# EAGLE design v1 (EAGLE 7.6.0)
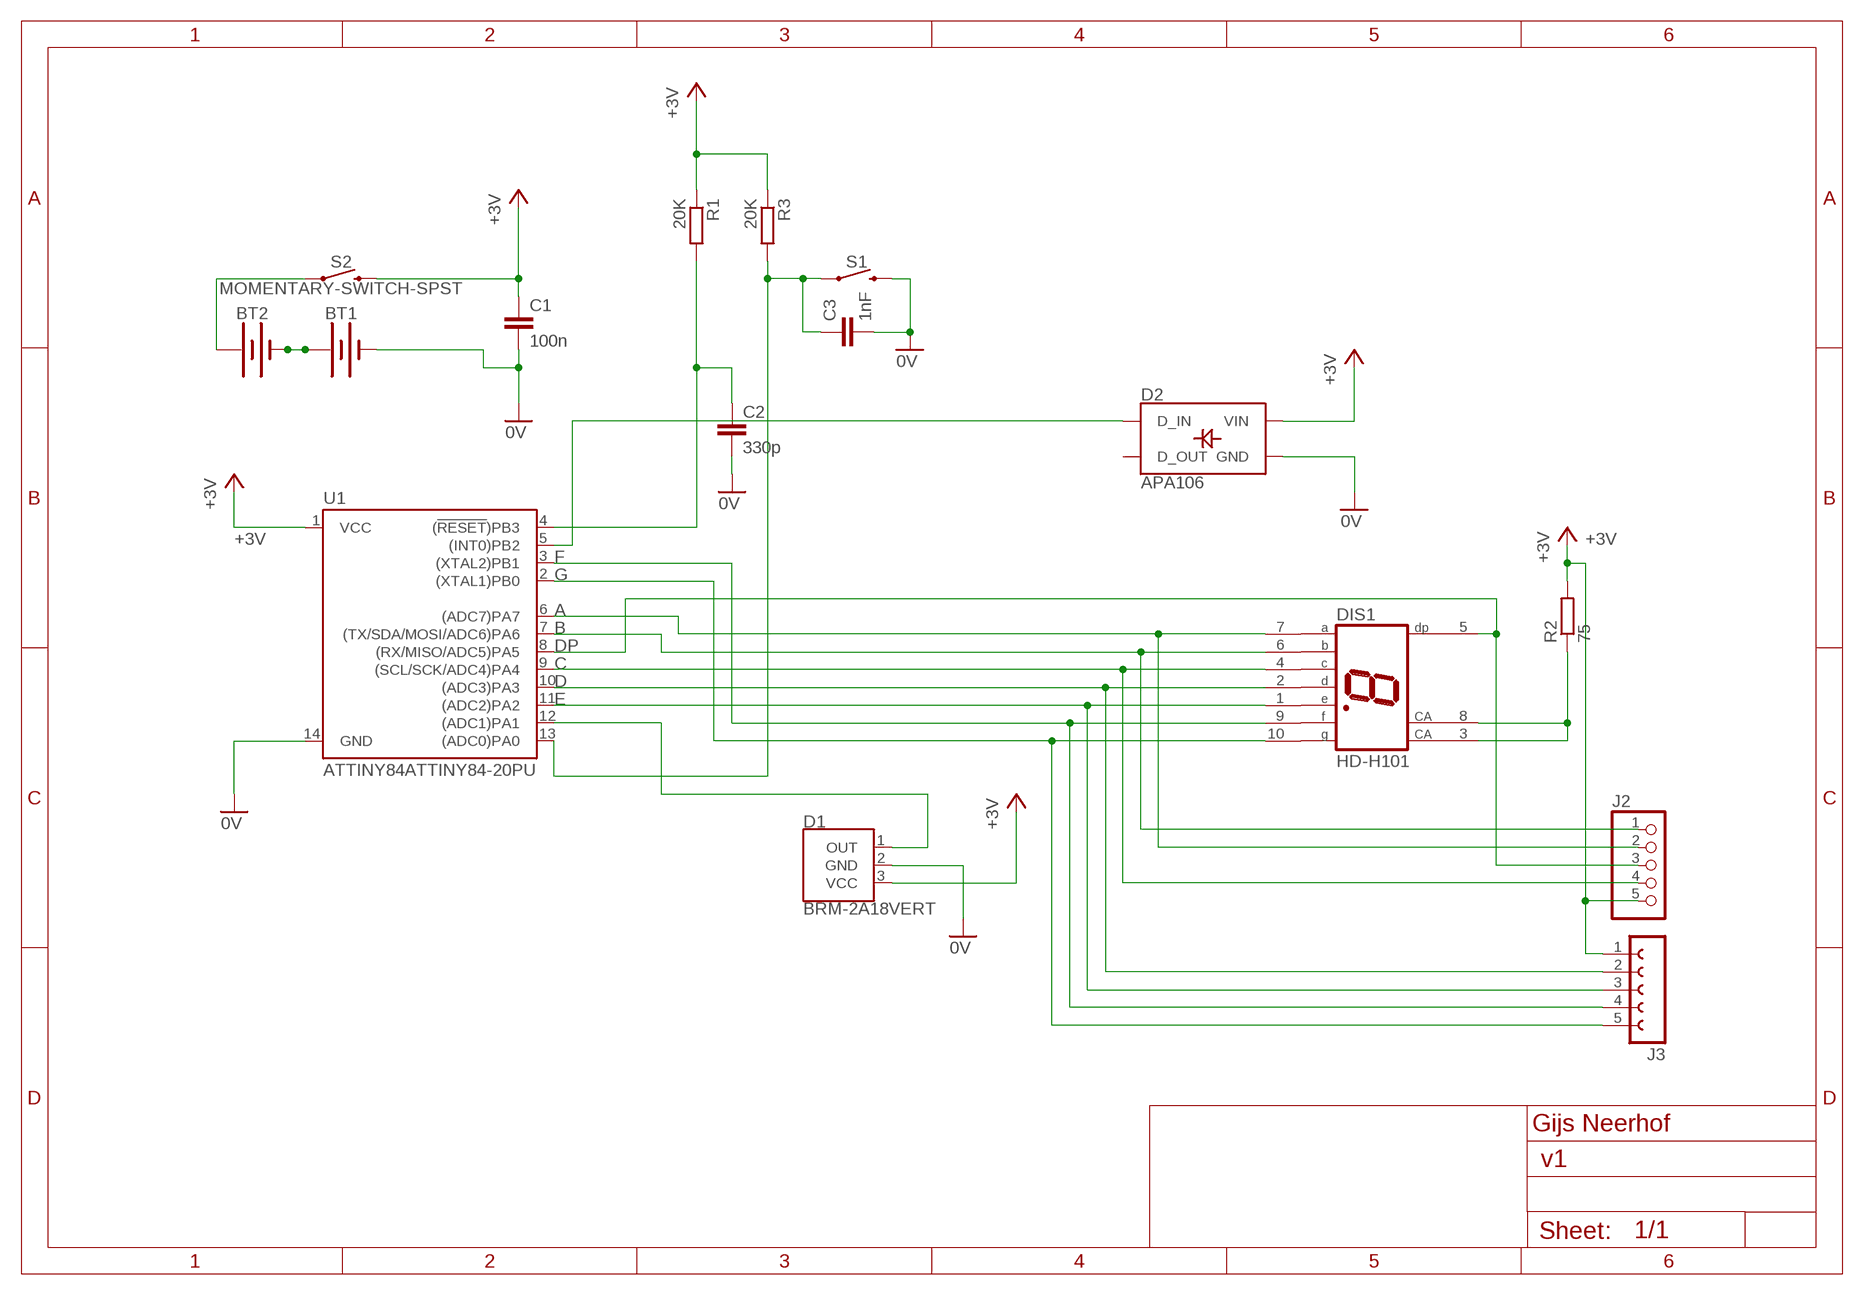
[diagram p0: schematic, sheet 1]

## Parts
BT1  BATTERY-AAA_KIT  [BATTERY-AAA-KIT]
BT2  BATTERY-AAA_KIT  [BATTERY-AAA-KIT]
C1  100n  C-EU050-030X075  [C050-030X075]
C2  330p  C-EU050-030X075  [C050-030X075]
C3  1nF  C-EU050-030X075  [C050-030X075]
D1  BRM-2A18VERT  [BRM-2508_VERT]
D2  APA106  [LED-RGB-THRU]
DIS1  HD-H101  [HDSP-M]
J2  PINHD-1X5/90  [1X05/90]
J3  FE05W  [FE05W]
R1  20K  R-EU_0207/10  [0207/10]
R2  75  R-EU_0207/10  [0207/10]
R3  20K  R-EU_0207/10  [0207/10]
S1  MOMENTARY-SWITCH-SPST-PTH-6.0MM  [TACTILE_SWITCH_PTH_6.0MM]
S2  MOMENTARY-SWITCH-SPST  [SAFETY_PIN_SWITCH]
U1  ATTINY84ATTINY84-20PU  [DIP14]

## Nets
+3V: D1.3(VCC) D2.2(VIN) J2.5 J3.1 R1.1 R2.2 R3.1 U1.1(VCC)
+5V: C1.1 S2.P$2 ; supply symbol labelled +3V
A: DIS1.7(A) J2.2 U1.6((ADC7)PA7)
B: DIS1.6(B) J2.1 U1.7((TX/SDA/MOSI/ADC6)PA6)
C: DIS1.4(C) J2.4 U1.9((SCL/SCK/ADC4)PA4)
D: DIS1.2(D) J3.2 U1.10((ADC3)PA3)
DP: DIS1.5(DP) J2.3 U1.8((RX/MISO/ADC5)PA5)
E: DIS1.1(E) J3.3 U1.11((ADC2)PA2)
F: DIS1.9(F) J3.4 U1.3((XTAL2)PB1)
G: DIS1.10(G) J3.5 U1.2((XTAL1)PB0)
GND: BT1.GND@1(-) BT1.GND@2(-) C1.2 C2.2 C3.2 D1.2(GND) D2.3(GND) S1.3 U1.14(GND) ; supply symbol labelled 0V
N$1: BT1.PWR@1(+) BT1.PWR@2(+) BT2.GND@1(-) BT2.GND@2(-)
N$3: BT2.PWR@1(+) BT2.PWR@2(+) S2.P$1
N$5: C3.1 R3.2 S1.1 U1.13((ADC0)PA0)
N$6: D1.1(OUT) U1.12((ADC1)PA1)
N$8: C2.1 R1.2 U1.4((!RESET!)PB3)
N$14: DIS1.3(CA) DIS1.8(CA) R2.1
N$18: D2.1(D_IN) U1.5((INT0)PB2)
Unconnected: D2.4(D_OUT)

## Notes on the sheet
- Gijs Neerhof

## Library data of the parts
BT1 BT2 = SparkFun-Batteries:BATTERY: Battery - Single Cell A variety of battery chemistries, sizes, and footprints. Device List: 20MM_PTH - Coin Cell Battery Holder - 20mm (PTH) <https://www.sparkfun.com/products/783> 6.8MM_PTH - Coin Cell Battery Holder - 6.8MM(SMD) <https://www.digikey.com/product-detail/en/seiko-instruments/MS621FE-FL11E/728-1057-ND/1889208?WT.srch=1&gclid=CNOQ5a6LzdQCFZS2wAodXCkE0g> 12MM_SMD - Coin Cell Battery Holder - 12mm (SMD) <https://www.sparkfun.com/products/10592> 12MM_PTH - Coin Cell Battery Holder - 12mm (PTH) <https://www.sparkfun.com/products/7948> 20MM_SMD - 20mm Coin Cell Battery Holder (SMD) (2 legs) Used on the Big Time Watch Kit <https://www.sparkfun.com/products/11734> 20MM_SMD_4LEGS - Coin Cell Battery Holder - 20mm (SMD) <https://www.sparkfun.com/products/11892> 20MM_SMD_4LEGS_OVERPASTE - Coin Cell Battery Holder - 20mm (SMD) <https://www.sparkfun.com/products/11892> (Over-paste on the legs) 24.5MM_PTH - Coin Cell Battery Holder - 24.5mm (PTH) <https://www.sparkfun.com/products/8863> 9V - 9V Battery Holder - PC Mount Used on the SparkFun SparkPunk Sound Kit <https://www.sparkfun.com/products/11177> and SparkFun SparkPunk Sequencer Kit <https://www.sparkfun.com/products/12707> 18650 - Battery Holder - 18650 (PTH) <https://www.sparkfun.com/products/13113> AA - Battery Holder - 1xAA (PTH) <https://www.sparkfun.com/products/7949> AAA - Battery Holder - 1xAAA (PTH) <https://www.sparkfun.com/products/12718> AA_KIT - Battery Holder - 1xAA (PTH) <https://www.sparkfun.com/products/7949> Special kit package - pads only have exposed copper on one side of the board. AAA_KIT - Battery Holder - 1xAAA (PTH) <https://www.sparkfun.com/products/12718> Special kit package - pads only have exposed copper on one side of the board.; PROD_ID: BATT-08571; SF_SKU: PRT-12718
C1-C3 = resistor:C-EU: CAPACITOR, European symbol
D1 = SparkFun-Sensors:BRM-2A18: BRM-2A18 IR Receiver The BRM-2A18 is miniaturized infrared receiver for remote control and other applications requiring improved ambient light rejection. Vertical package is a primary component on the ZX Distance and Gesture Sensor. RA package is not currently in-use. Example Datasheet <http://www.sinoskysun.com/upload/20110512/201105120447164615.PDF> SparkFun Products ZX Distance and Gesture Sensor <https://www.sparkfun.com/products/12780> (COM-12780); PROD_ID: COMP-12505
D2 = SparkFun-LED:APA106
DIS1 = display-hp:HD-H101: LED DISPLAY 1-character 7 segment, decimal point right; OC_FARNELL: unknown; OC_NEWARK: unknown
J2 = pinhead:PINHD-1X5: PIN HEADER
J3 = con-lsta:FE05W: FEMALE HEADER; OC_FARNELL: unknown; OC_NEWARK: unknown
R1-R3 = resistor:R-EU_: RESISTOR, European symbol
S1 = SparkFun-Switches:MOMENTARY-SWITCH-SPST: Momentary Switch (Pushbutton) - SPST Normally-open (NO) SPST momentary switches (buttons, pushbuttons). Variants PTH-12MM - 12mm square, through-hole Momentary Pushbutton Switch - 12mm Square <https://www.sparkfun.com/products/9190> (COM-09190) PTH-6.0MM, PTH-6.0MM-KIT - 6.0mm square, through-hole Mini Pushbutton Switch <https://www.sparkfun.com/products/97> (COM-00097) KIT package intended for soldering kit's - only one side of pads' copper is exposed. PTH-RIGHT-ANGLE-KIT - Right-angle, through-hole Right Angle Tactile Button <https://www.sparkfun.com/products/10791> - Used on SparkFun BigTime Watch Kit <https://www.sparkfun.com/products/11734> SMD-12MM - 12mm square, surface-mount Tactile Button - SMD (12mm) <https://www.sparkfun.com/products/12993> (COM-12993) Used on SparkFun PicoBoard <https://www.sparkfun.com/products/11888> SMD-4.5MM - 4.5mm Square Trackball Switch Used on SparkFun Blackberry Trackballer Breakout <https://www.sparkfun.com/products/13169> SMD-4.6MMX2.8MM - 4.60mm x 2.80mm, surface mount Used on SparkFun SAMD21 Mini Breakout <https://www.sparkfun.com/products/13664> SMD-5.2MM, SMD-5.2-REDUNDANT - 5.2mm square, surface-mount Mini Pushbutton Switch - SMD <https://www.sparkfun.com/products/8720> (COM-08720) Used on Arduino Pro Mini <https://www.sparkfun.com/products/11114> REDUNDANT package connects both switch circuits together SMD-6.0X3.5MM - 6.0 x 3.5mm, surface mount Momentary Reset Switch SMD <https://www.sparkfun.com/products/8229> (COM-08229) SMD-6.2MM-TALL - 6.2mm square, surface mount Tactile Button - SMD (6mm) <https://www.sparkfun.com/products/12992> Used on SparkFun Digital Sandbox <https://www.sparkfun.com/products/12651> SMD-RIGHT-ANGLE - Right-angle, surface mount Used on SparkFun Block for Intel® Edison - Arduino <https://www.sparkfun.com/products/13036>; PROD_ID: SWCH-08441; SF_SKU: COM-00097
S2 = SparkFun-Switches:MOMENTARY-SWITCH-SPST: Momentary Switch (Pushbutton) - SPST Normally-open (NO) SPST momentary switches (buttons, pushbuttons). Variants PTH-12MM - 12mm square, through-hole Momentary Pushbutton Switch - 12mm Square <https://www.sparkfun.com/products/9190> (COM-09190) PTH-6.0MM, PTH-6.0MM-KIT - 6.0mm square, through-hole Mini Pushbutton Switch <https://www.sparkfun.com/products/97> (COM-00097) KIT package intended for soldering kit's - only one side of pads' copper is exposed. PTH-RIGHT-ANGLE-KIT - Right-angle, through-hole Right Angle Tactile Button <https://www.sparkfun.com/products/10791> - Used on SparkFun BigTime Watch Kit <https://www.sparkfun.com/products/11734> SMD-12MM - 12mm square, surface-mount Tactile Button - SMD (12mm) <https://www.sparkfun.com/products/12993> (COM-12993) Used on SparkFun PicoBoard <https://www.sparkfun.com/products/11888> SMD-4.5MM - 4.5mm Square Trackball Switch Used on SparkFun Blackberry Trackballer Breakout <https://www.sparkfun.com/products/13169> SMD-4.6MMX2.8MM - 4.60mm x 2.80mm, surface mount Used on SparkFun SAMD21 Mini Breakout <https://www.sparkfun.com/products/13664> SMD-5.2MM, SMD-5.2-REDUNDANT - 5.2mm square, surface-mount Mini Pushbutton Switch - SMD <https://www.sparkfun.com/products/8720> (COM-08720) Used on Arduino Pro Mini <https://www.sparkfun.com/products/11114> REDUNDANT package connects both switch circuits together SMD-6.0X3.5MM - 6.0 x 3.5mm, surface mount Momentary Reset Switch SMD <https://www.sparkfun.com/products/8229> (COM-08229) SMD-6.2MM-TALL - 6.2mm square, surface mount Tactile Button - SMD (6mm) <https://www.sparkfun.com/products/12992> Used on SparkFun Digital Sandbox <https://www.sparkfun.com/products/12651> SMD-RIGHT-ANGLE - Right-angle, surface mount Used on SparkFun Block for Intel® Edison - Arduino <https://www.sparkfun.com/products/13036>
U1 = SparkFun-IC-Microcontroller:ATTINY84: Atmel 14-pin 2/4/8kB flash uC Datasheet <https://cdn.sparkfun.com/datasheets/Widgets/doc8006.pdf> SparkFun Products Tiny AVR Programmer <https://www.sparkfun.com/products/11801> (PGM-11801) SparkFun Servo Trigger - Continuous Rotation <https://www.sparkfun.com/products/13872> (WIG-13872) SparkFun Servo Trigger <https://www.sparkfun.com/products/13118> (WIG-13118)

## Board
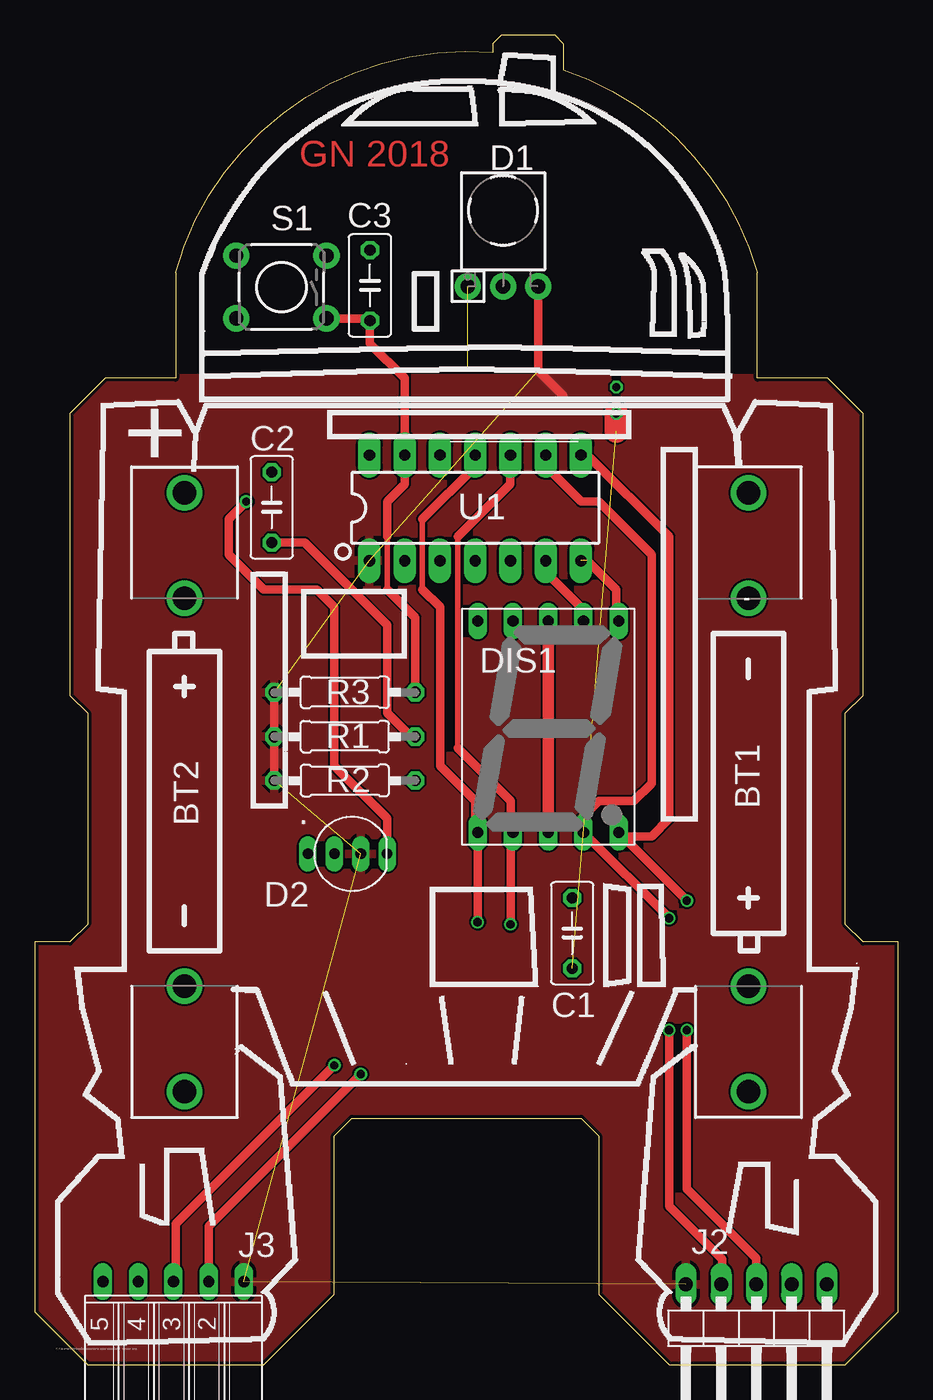
[diagram p1: board, top side]
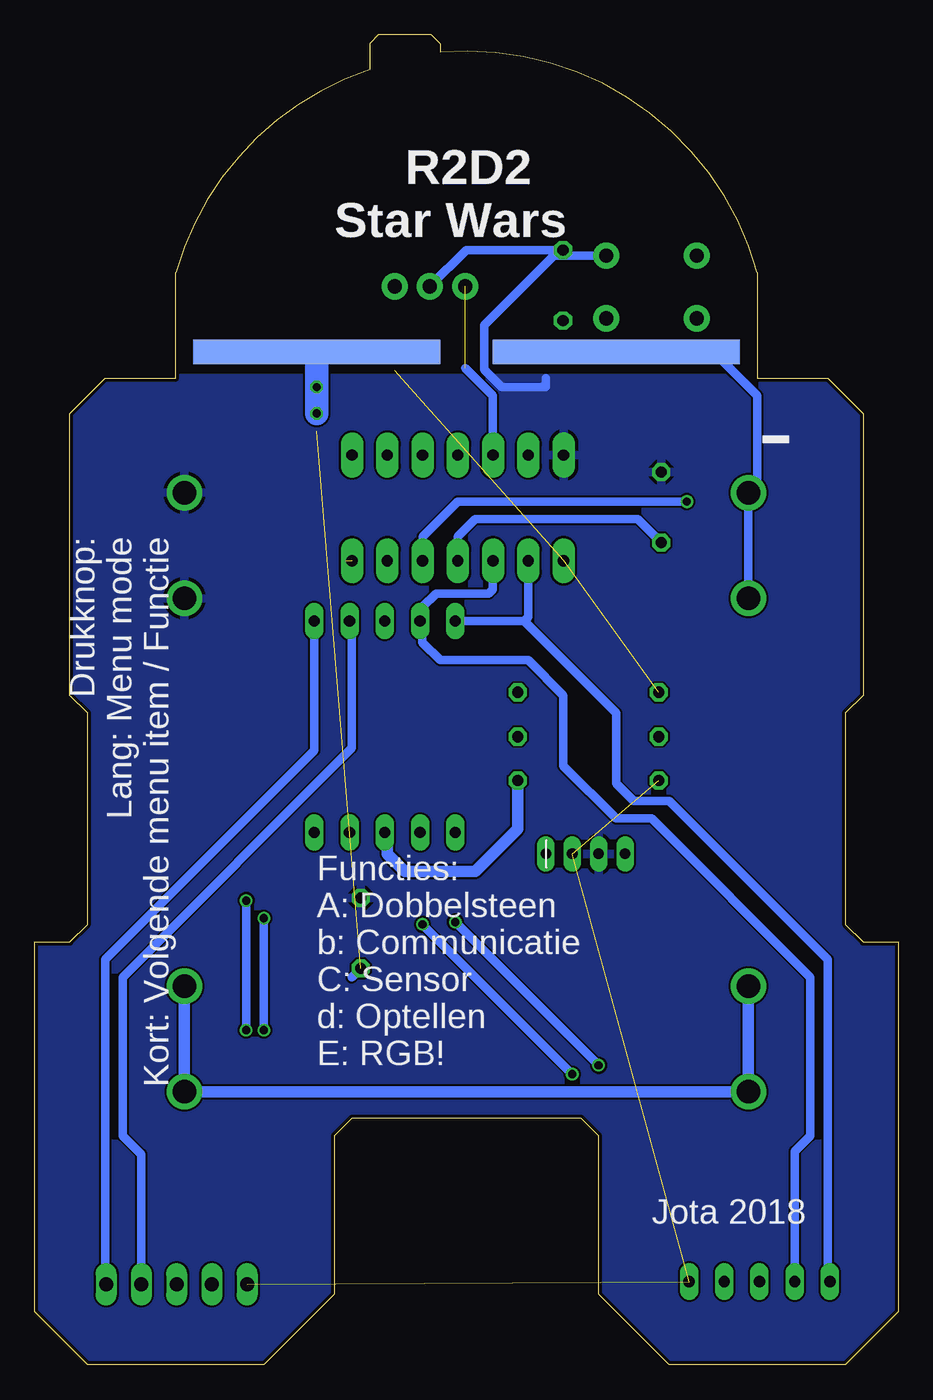
[diagram p2: board, bottom side, seen from below]

Size 62.23 x 95.89 mm. Coordinates in mm from the lower left corner, seen from the top.
Outline: 3.81,0 16.51,0 21.59,5.08 21.59,16.51 22.86,17.78 39.37,17.78 40.64,16.51 40.64,5.08 45.72,0 58.42,0 62.23,3.81 62.23,30.48 59.69,30.48 58.42,31.75 58.42,46.99 59.69,48.26 59.69,68.58 57.15,71.12 52.07,71.12 52.07,78.74 arc56 38.1,93.34 38.1,95.25 37.47,95.89 33.66,95.89 33.02,95.25 33.02,94.61 arc80 10.16,78.74 10.16,71.12 5.08,71.12 2.54,68.58 2.54,48.26 3.81,46.99 3.81,31.75 2.54,30.48 0,30.48 0,3.81 3.81,0
Copper layers (1*16): Top 0.035mm / dielectric 1.5mm / Bottom 0.035mm
Design rules "SeeedStudio_2layer_DRU_no_angle_20140221": minimum track width 6mil, minimum drill 12mil, track to track 6mil, track to pad 6mil, pad to pad 6mil, via to via 6mil, smd to smd 0mil, copper to edge 10mil, drill to drill 10mil, minimum pad ring 10mil, minimum via ring 6mil, stop-mask expansion 2mil, vias tented up to drill 100mil, thermal gap 10mil

### Footprints (pad centres in the part's own frame; a part is rotated, then mirrored left to right if it is on the bottom)
BATTERY-AAA-KIT = drill 1.702: GND@1 21.59,0; GND@2 13.97,0; PWR@1 -21.59,0; PWR@2 -13.97,0
C050-030X075 = drill 0.813 octagon: 1 -2.54,0; 2 2.54,0
BRM-2508_VERT = drill 1.016 pad 1.88: 1 -2.54,0; 2 0,0; 3 2.54,0
LED-RGB-THRU = drill 0.762 pad 0.889 long: 1 2.54,0; 2 0.635,0; 3 -1.27,0; 4 -3.175,0
HDSP-M = drill 0.813 long: 1 -5.08,-7.62; 2 -2.54,-7.62; 3 0,-7.62; 4 2.54,-7.62; 5 5.08,-7.62; 6 5.08,7.62; 7 2.54,7.62; 8 0,7.62; 9 -2.54,7.62; 10 -5.08,7.62
1X05/90 = drill 1.016 long: 1 -5.08,-3.81; 2 -2.54,-3.81; 3 0,-3.81; 4 2.54,-3.81; 5 5.08,-3.81
FE05W = drill 0.813 long: 1 -5.08,0; 2 -2.54,0; 3 0,0; 4 2.54,0; 5 5.08,0
0207/10 = drill 0.813 octagon: 1 -5.08,0; 2 5.08,0
TACTILE_SWITCH_PTH_6.0MM = drill 1.016 pad 1.88: 1 -3.251,2.261; 2 3.251,2.261; 3 -3.251,-2.261; 4 3.251,-2.261
SAFETY_PIN_SWITCH = smd 17.78 x 1.778: P$1 -10.795,-1.27; P$2 10.795,-1.27
DIP14 = drill 0.813 pad 1.626 long: 1 -7.62,-3.81; 2 -5.08,-3.81; 3 -2.54,-3.81; 4 0,-3.81; 5 2.54,-3.81; 6 5.08,-3.81; 7 7.62,-3.81; 8 7.62,3.81; 9 5.08,3.81; 10 2.54,3.81; 11 0,3.81; 12 -2.54,3.81; 13 -5.08,3.81; 14 -7.62,3.81

### Placement (x,y rotation side)
BT1  51.44,41.27 90 top
BT2  10.79,41.27 270 top
C1  38.73,31.11 90 top
C2  17.08,61.81 90 top
C3  24.16,77.81 90 top
D1  33.75,77.74 0 top
D2  22.86,36.83 0 top
DIS1  37,46 0 top
J2  52,2 180 top
J3  10,6 180 top
R1  22.34,45.28 0 top
R2  22.34,42.12 180 top
R3  22.34,48.48 0 top
S1  17.78,77.69 180 top
S2  31.11,71.75 180 bottom
U1  31.74,61.77 0 top
U$1  [A4L-LOC]  -92.71,-36.83 0 top  (outside the outline)

### Tracks (layer width: path | path; a pad name or v marks a point on that pad's centre or on a via)
+3V  (5 unrouted)
  Top 0.61: R3.1 R1.1 R2.2 | D1.3 36.29,71.66 38.1,69.85
  pour Top: 5.08,71.12 2.54,68.58 2.54,48.26 3.81,46.99 3.81,31.75 2.54,30.48 0,30.48 0,3.81 3.81,0 16.51,0 21.59,5.08 21.59,16.51 22.86,17.78 39.37,17.78 40.64,16.51 40.64,5.08 45.72,0 58.42,0 62.23,3.81 62.23,30.48 59.69,30.48 58.42,31.75 58.42,46.99 59.69,48.26 59.69,68.58 57.15,71.12 52.07,71.12
+5V  (via drill 0.6)  (1 unrouted)
  Top 1.676: v41.91,68.58 41.91,67.31
  Bottom 0.61: 39.37,27.94 C1.1
  Bottom 1.676: S2.P$2 v41.91,70.48 v41.91,68.58
A
  Top 0.61: DIS1.7 39.54,54.44 36.83,57.15 U1.6
  Bottom 0.61: J2.2 54.54,15.17 55.88,16.51 55.88,27.94 39.37,44.45 39.37,53.45 DIS1.7
B  (1 unrouted)
  Top 0.61: 39.83,57.96 41.91,55.88 41.91,53.79 DIS1.6
  Bottom 0.61: DIS1.6 42.08,44.28 57.15,29.21 57.15,5.88 J2.1
C  (via drill 0.6)
  Top 0.61: U1.9 36.82,64.78 39.37,62.23 40.64,62.23 44.45,58.42 44.45,41.91 43.18,40.64 40.64,40.64 39.37,39.37 39.37,38.55 DIS1.4 v45.72,32.2 | J2.4 49.53,5.88 49.53,7.62 45.72,11.43 v45.72,24.13
  Bottom 0.61: v45.72,32.2 v45.72,24.13
D  (via drill 0.6)
  Top 0.406: 30.48,59.69 30.48,44.45
  Top 0.61: U1.10 34.28,63.49 30.48,59.69 | 30.48,44.45 34.29,40.64 34.29,38.55 DIS1.2 34.29,38.21 v34.29,31.75 | J3.2 12.54,10 v23.5,20.95
  Bottom 0.61: v34.29,31.75 v23.5,20.95
DP  (via drill 0.6)
  Top 0.61: U1.8 39.83,65.58 45.72,59.69 45.72,39.37 44.45,38.1 42.36,38.1 DIS1.5 v46.99,33.47 | J2.3 52,7.69 46.99,12.7 v46.99,24.13
  Bottom 0.61: v46.99,33.47 v46.99,24.13
E  (via drill 0.6)
  Top 0.406: 27.94,60.96 27.94,55.88
  Top 0.61: U1.11 31.74,64.76 27.94,60.96 | 27.94,55.88 29.21,54.61 29.21,43.18 31.75,40.64 31.75,38.55 DIS1.1 v31.92,31.92 | J3.3 10.16,6.16 10.16,10.16 v21.59,21.59
  Bottom 0.61: v31.92,31.92 v21.59,21.59
F
  Bottom 0.61: J3.4 7.46,15.4 6.35,16.51 6.35,27.94 17.78,39.37 20.32,39.37 24.13,43.18 24.13,48.26 26.67,50.8 33.02,50.8 34.29,52.07 34.29,53.45 | 34.29,53.45 DIS1.9 | 34.29,53.45 34.29,54.61 33.28,55.59 29.5,55.59 29.21,55.88 U1.3
G
  Bottom 0.61: DIS1.10 26.95,53.62 | 26.95,53.62 20.32,46.99 20.32,41.91 19.05,40.64 16.51,40.64 5.08,29.21 5.08,6.16 J3.5 | U1.2 26.66,53.91 26.95,53.62
GND
  Bottom 0.61: S1.3 23.76,79.95 | 23.76,79.95 C3.2 31.14,80.35 D1.2 | 23.76,79.95 24.82,79.95 29.84,74.93 29.84,71.75 28.57,70.48 25.4,70.48 25.4,71.12
  pour Bottom: 5.08,71.12 2.54,68.58 2.54,48.26 3.81,46.99 3.81,31.75 2.54,30.48 0,30.48 0,3.81 3.81,0 16.51,0 21.59,5.08 21.59,16.51 22.86,17.78 39.37,17.78 40.64,16.51 40.64,5.08 45.72,0 58.42,0 62.23,3.81 62.23,30.48 59.69,30.48 58.42,31.75 58.42,46.99 59.69,48.26 59.69,68.58 57.15,71.12 52.07,71.12
N$1
  Bottom 0.813: BT2.GND@2 BT2.GND@1 BT1.PWR@1 BT1.PWR@2
N$3
  Bottom 0.61: S2.P$1 13.34,73.03 10.16,69.85 10.16,63.5 BT2.PWR@1 BT2.PWR@2
N$5
  Top 0.406: 25.4,55.88 25.4,59.69
  Top 0.61: S1.1 24,75.43 C3.1 24.16,73.63 26.67,71.12 U1.13 26.67,63.5 25.4,62.23 25.4,59.69 | R3.2 27.42,53.86 25.4,55.88
N$6  (1 unrouted)
  Bottom 0.61: 31.21,71.85 29.21,69.85 U1.12
N$8
  Top 0.61: R1.2 27.11,45.28 25.4,46.99 25.4,53.34 19.47,59.27 C2.1
  Bottom 0.61: U1.4 31.74,59.7 30.48,60.96 18.77,60.96 C2.1
N$14
  Top 0.813: DIS1.3 DIS1.8
  Bottom 0.813: R2.1 27.42,38.62 30.48,35.56 35.56,35.56 36.83,36.83 36.83,38.21 DIS1.3
N$18  (via drill 0.6)
  Top 0.61: v15.24,62.23 13.97,60.96 13.97,58.42 16.51,55.88 20.32,55.88 21.59,54.61 21.59,43.18 25.4,39.37 D2.1
  Bottom 0.61: U1.5 34.28,59.7 31.75,62.23 v15.24,62.23

### Text on the board
Top: GN 2018
tNames: + | . | D2 | C:/Users/s151568/Documents/eagle/Jota/R2D2_Vector.bmp
bNames: R2D2 | Star Wars | - | Drukknop: / Lang: Menu mode / Kort: Volgende menu item / Functie | Functies: / A: Dobbelsteen / b: Communicatie / C: Sensor / d: Optellen / E: RGB! | Jota 2018